# EAGLE design schematics (EAGLE 9.6.2)
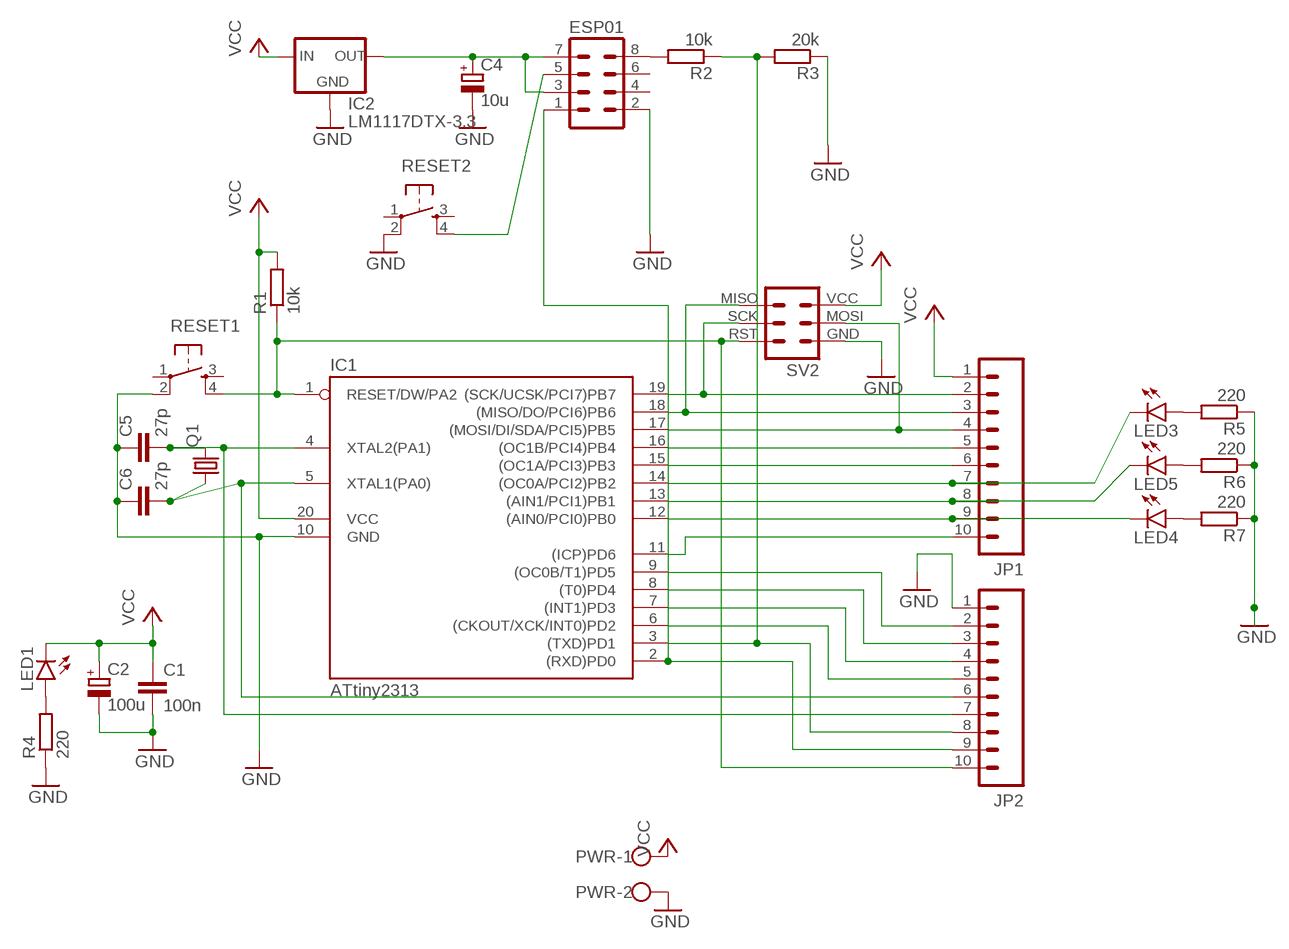
[diagram p0: schematic, sheet 1]

## Parts
C1  100n  C-EU025-025X050  [C025-025X050]
C2  100u  CPOL-EUE2.5-5  [E2,5-5]
C4  10u  CPOL-EUE2.5-5  [E2,5-5]
C5  27p  C2.5/2  [C2.5-2]
C6  27p  C2.5/2  [C2.5-2]
ESP01  MA04-2  [MA04-2]
IC1  ATtiny2313  ATTINY2313-20P  [DIL20]
IC2  LM1117DTX-3.3  [TO252]
JP1  M100.1  [1X10]
JP2  M100.1  [1X10]
LED1  LED3MM  [LED3MM]
LED3  LED3MM  [LED3MM]
LED4  LED3MM  [LED3MM]
LED5  LED3MM  [LED3MM]
PWR  W237-102  [W237-102]
Q1  CRYSTALHC49S  [HC49/S]
R1  10k  R-EU_0207/5V  [0207/5V]
R2  10k  R-EU_0207/5V  [0207/5V]
R3  20k  R-EU_0207/5V  [0207/5V]
R4  220  R-EU_0207/5V  [0207/5V]
R5  220  R-EU_0207/5V  [0207/5V]
R6  220  R-EU_0207/5V  [0207/5V]
R7  220  R-EU_0207/5V  [0207/5V]
RESET1  TAC_SWITCHPTH  [TACTILE-PTH]
RESET2  TAC_SWITCHPTH  [TACTILE-PTH]
SV2  MA03-2  [MA03-2]

## Nets
GND: C1.2 C2.- C4.- C5.1 C6.1 ESP01.2 IC1.10(GND) IC2.1(GND) JP2.1 PWR.2 R3.1 R4.1 R5.1 R6.1 R7.1 RESET1.2 RESET2.2 SV2.GND
N$1: C4.+ ESP01.3 ESP01.7 IC2.TAB(OUT)
N$2: C5.2 IC1.4(XTAL2(PA1)) JP2.7 Q1.2
N$3: C6.2 IC1.5(XTAL1(PA0)) JP2.6 Q1.1
N$4: IC1.1(RESET/DW/PA2) JP2.10 R1.1 RESET1.4 SV2.RST
N$5: IC1.19((SCK/UCSK/PCI7)PB7) JP1.2 SV2.SCK
N$6: IC1.18((MISO/DO/PCI6)PB6) JP1.3 SV2.MISO
N$7: IC1.17((MOSI/DI/SDA/PCI5)PB5) JP1.4 SV2.MOSI
N$8: IC1.16((OC1B/PCI4)PB4) JP1.5
N$9: IC1.15((OC1A/PCI3)PB3) JP1.6
N$10: IC1.14((OC0A/PCI2)PB2) JP1.7 LED3.K(C)
N$11: IC1.13((AIN1/PCI1)PB1) JP1.8 LED5.K(C)
N$12: IC1.12((AIN0/PCI0)PB0) JP1.9 LED4.K(C)
N$13: IC1.11((ICP)PD6) JP1.10
N$14: IC1.9((OC0B/T1)PD5) JP2.2
N$15: IC1.8((T0)PD4) JP2.3
N$16: IC1.7((INT1)PD3) JP2.4
N$17: IC1.6((CKOUT/XCK/INT0)PD2) JP2.5
N$18: IC1.3((TXD)PD1) JP2.8 R2.1 R3.2
N$19: ESP01.5 RESET2.4
N$20: ESP01.8 R2.2
N$22: LED1.A R4.2
N$23: LED3.A R5.2
N$24: LED5.A R6.2
N$25: LED4.A R7.2
RX: ESP01.1 IC1.2((RXD)PD0) JP2.9
VCC: C1.1 C2.+ IC1.20(VCC) IC2.2(IN) JP1.1 LED1.K(C) PWR.1 R1.2 SV2.VCC
Unconnected: ESP01.4 ESP01.6 RESET1.1 RESET1.3 RESET2.1 RESET2.3

## Library data of the parts
C1 = rcl:C-EU: CAPACITOR, European symbol; SPICEPREFIX: C
C2 C4 = rcl:CPOL-EU: POLARIZED CAPACITOR, European symbol; SPICEPREFIX: C
C5 C6 = capacitor-wima:C: CAPACITOR naming: grid - package width
ESP01 = con-lstb:MA04-2: PIN HEADER; OC_FARNELL: unknown; OC_NEWARK: unknown
IC1 = avr:ATTINY2313: MICROCONTROLLER 2 Kbytes FLASH 128 bytes SRAM 128 bytes EEPROM USART USI
IC2 = lm1117:LM1117DTX-*
JP1 JP2 = SparkFun:M10: Header 10 Standard 10-pin 0.1" header. Use with straight break away headers (SKU : PRT-00116), right angle break away headers (PRT-00553), swiss pins (PRT-00743), machine pins (PRT-00117), and female headers (PRT-00115).
LED1 LED3-LED5 = led:LED: LED OSRAM: - CHIPLED LG R971, LG N971, LY N971, LG Q971, LY Q971, LO R971, LY R971 LH N974, LH R974 LS Q976, LO Q976, LY Q976 LO Q996 - Hyper CHIPLED LW Q18S LB Q993, LB Q99A, LB R99A - SideLED LS A670, LO A670, LY A670, LG A670, LP A670 LB A673, LV A673, LT A673, LW A673 LH A674 LY A675 LS A676, LA A676, LO A676, LY A676, LW A676 LS A679, LY A679, LG A679 - Hyper Micro SIDELED® LS Y876, LA Y876, LO Y876, LY Y876 LT Y87S - SmartLED LW L88C, LW L88S LB L89C, LB L89S, LG L890 LS L89K, LO L89K, LY L89K LS L896, LA L896, LO L896, LY L896 - TOPLED LS T670, LO T670, LY T670, LG T670, LP T670 LSG T670, LSP T670, LSY T670, LOP T670, LYG T670 LG T671, LOG T671, LSG T671 LB T673, LV T673, LT T673, LW T673 LH T674 LS T676, LA T676, LO T676, LY T676, LB T676, LH T676, LSB T676, LW T676 LB T67C, LV T67C, LT T67C, LS T67K, LO T67K, LY T67K, LW E67C LS E67B, LA E67B, LO E67B, LY E67B, LB E67C, LV E67C, LT E67C LW T67C LS T679, LY T679, LG T679 LS T770, LO T770, LY T770, LG T770, LP T770 LB T773, LV T773, LT T773, LW T773 LH T774 LS E675, LA E675, LY E675, LS T675 LS T776, LA T776, LO T776, LY T776, LB T776 LHGB T686 LT T68C, LB T68C - Hyper Mini TOPLED® LB M676 - Mini TOPLED Santana® LG M470 LS M47K, LO M47K, LY M47K Source: http://www.osram.convergy.de LUXEON: - LUMILED® LXK2-PW12-R00, LXK2-PW12-S00, LXK2-PW14-U00, LXK2-PW14-V00 LXK2-PM12-R00, LXK2-PM12-S00, LXK2-PM14-U00 LXK2-PE12-Q00, LXK2-PE12-R00, LXK2-PE12-S00, LXK2-PE14-T00, LXK2-PE14-U00 LXK2-PB12-K00, LXK2-PB12-L00, LXK2-PB12-M00, LXK2-PB14-N00, LXK2-PB14-P00, LXK2-PB14-Q00 LXK2-PR12-L00, LXK2-PR12-M00, LXK2-PR14-Q00, LXK2-PR14-R00 LXK2-PD12-Q00, LXK2-PD12-R00, LXK2-PD12-S00 LXK2-PH12-R00, LXK2-PH12-S00 LXK2-PL12-P00, LXK2-PL12-Q00, LXK2-PL12-R00 Source: www.luxeon.com KINGBRIGHT: KA-3528ASYC Source: www.kingbright.com
PWR = con-wago-500:W237-102: WAGO SCREW CLAMP; MPN: 237-102; OC_FARNELL: unknown; OC_NEWARK: 70K9898
Q1 = crystal:CRYSTAL: CRYSTAL; OC_FARNELL: 1667008; OC_NEWARK: unknown
R1-R7 = rcl:R-EU_: RESISTOR, European symbol; SPICEPREFIX: R
RESET1 RESET2 = SparkFun:TAC_SWITCH: Momentary Switch Button commonly used for reset or general input. Spark Fun Electronics SKU : COM-00097
SV2 = alex:MA03-2: PIN HEADER

## Board
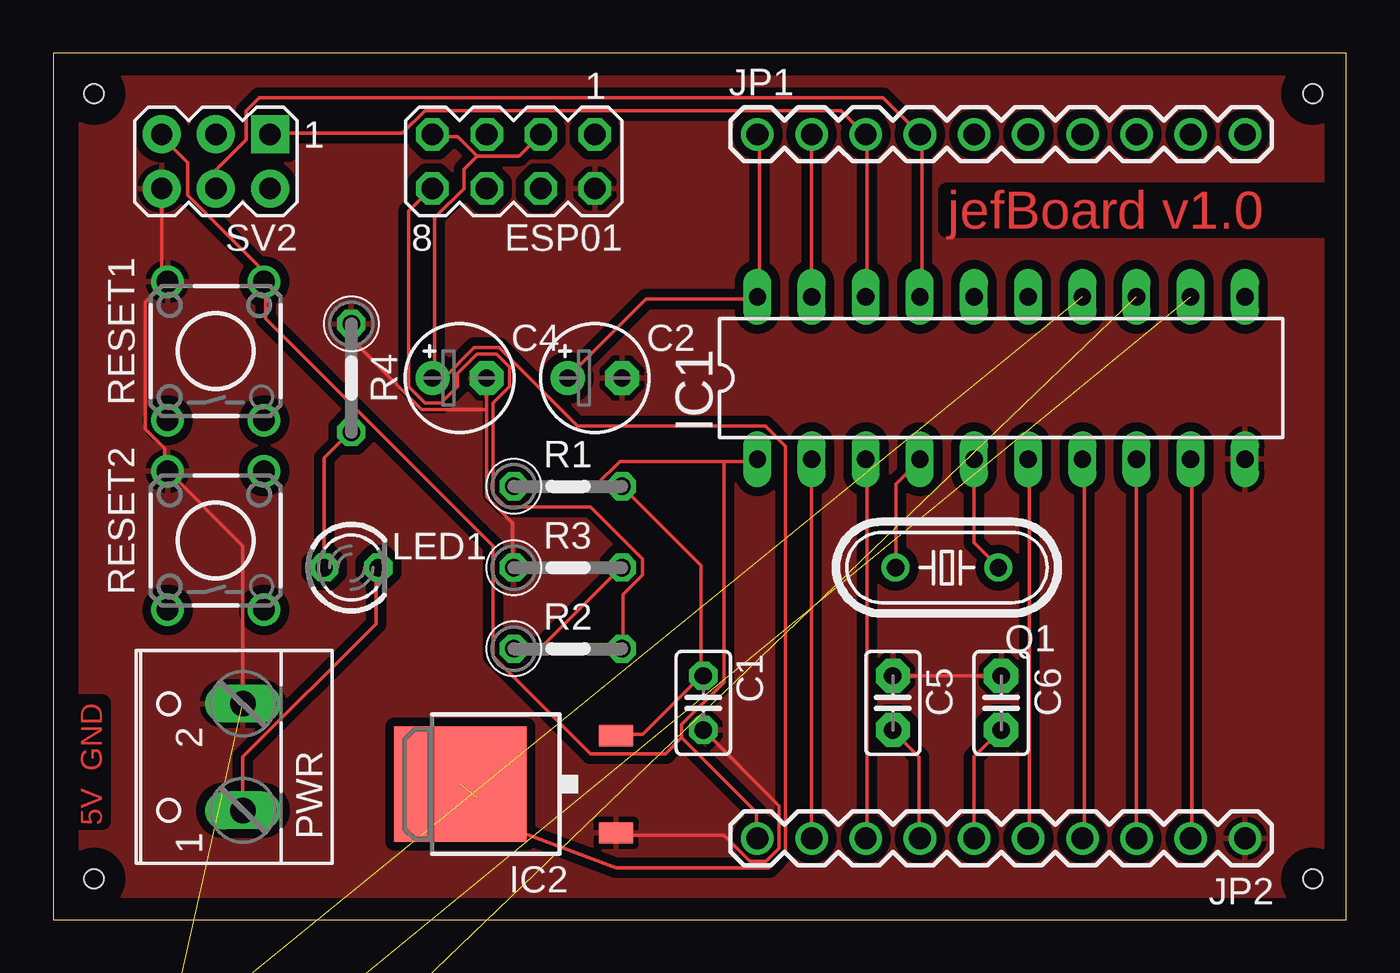
[diagram p1: board, top side]
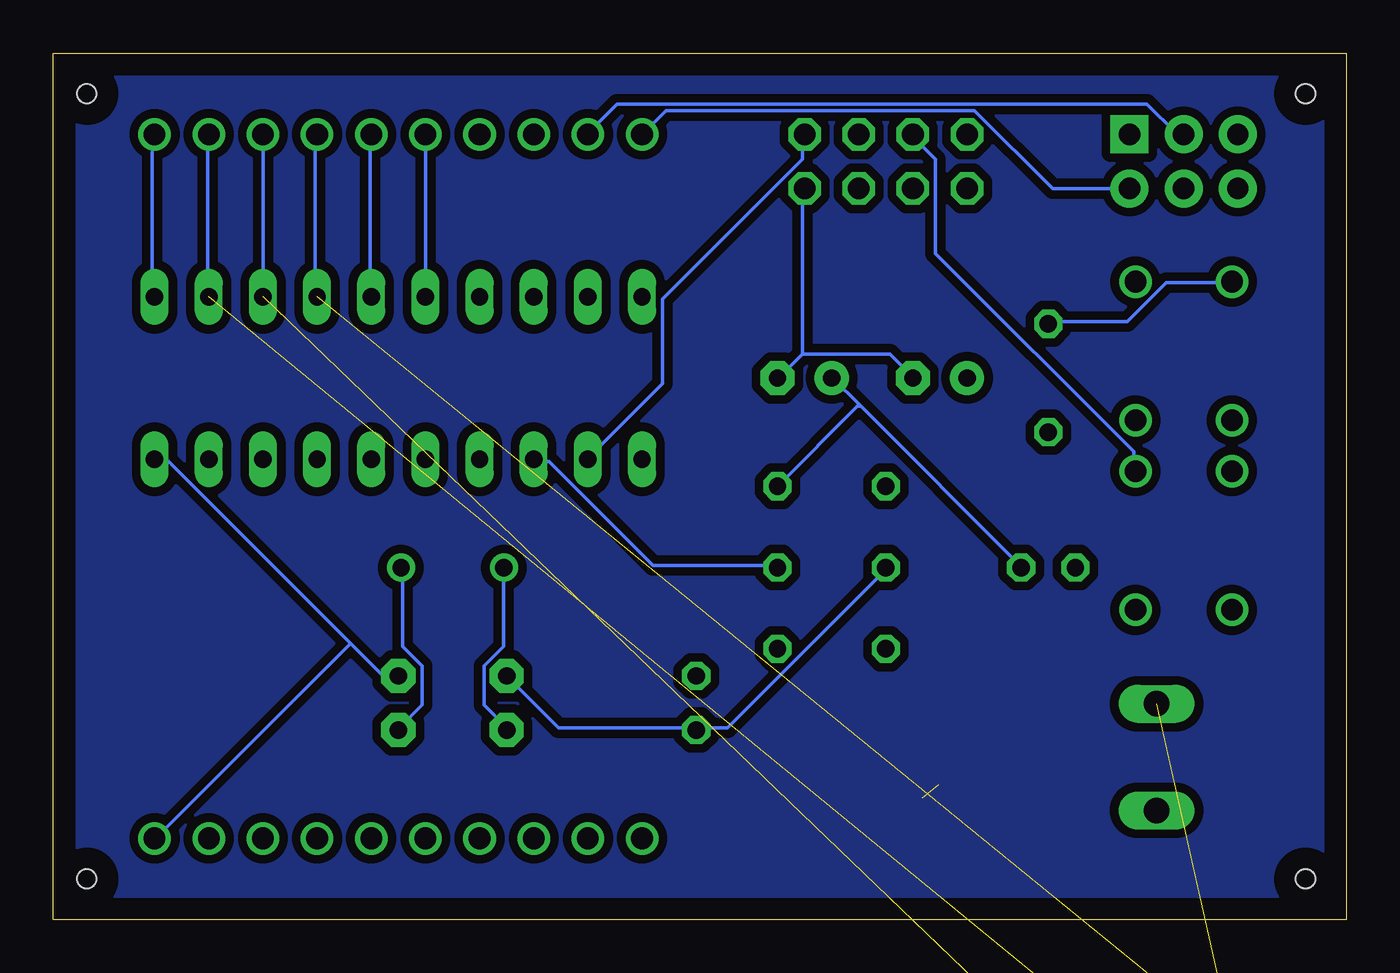
[diagram p2: board, bottom side, seen from below]

Size 60.63 x 40.63 mm. Coordinates in mm from the lower left corner, seen from the top.
Outline: 0,0 60.63,0 60.63,40.63 0,40.63 0,0
Copper layers (1*16): Top 0.035mm / dielectric 1.5mm / Bottom 0.035mm
Design rules "default": minimum track width 6mil, minimum drill 0.35mm, track to track 6mil, track to pad 6mil, pad to pad 6mil, via to via 6mil, smd to smd 6mil, copper to edge 40mil, drill to drill 6mil, minimum pad ring 10mil, minimum via ring 8mil, stop-mask expansion 4mil, vias tented up to drill 0mil, thermal gap 10mil
Holes 0.89 mm at 1.91,38.73 1.91,1.91 59.05,38.73 59.05,1.91

### Footprints (pad centres in the part's own frame; a part is rotated, then mirrored left to right if it is on the bottom)
C025-025X050 = drill 0.813 octagon: 1 -1.27,0; 2 1.27,0
E2,5-5 = drill 0.813 pad 1.6: + -1.27,0 | drill 0.813 pad 1.6 octagon: - 1.27,0
C2.5-2 = drill 0.813 pad 1.6 octagon: 1 -1.27,0; 2 1.27,0
MA04-2 = drill 1.016 octagon: 1 -3.81,-1.27; 2 -3.81,1.27; 3 -1.27,-1.27; 4 -1.27,1.27; 5 1.27,-1.27; 6 1.27,1.27; 7 3.81,-1.27; 8 3.81,1.27
DIL20 = drill 0.813 long: 1 -11.43,-3.81; 2 -8.89,-3.81; 3 -6.35,-3.81; 4 -3.81,-3.81; 5 -1.27,-3.81; 6 1.27,-3.81; 7 3.81,-3.81; 8 6.35,-3.81; 9 8.89,-3.81; 10 11.43,-3.81; 11 11.43,3.81; 12 8.89,3.81; 13 6.35,3.81; 14 3.81,3.81; 15 1.27,3.81; 16 -1.27,3.81; 17 -3.81,3.81; 18 -6.35,3.81; 19 -8.89,3.81; 20 -11.43,3.81
TO252 = smd 1 x 1.6: 1 -2.28,-4.8; 2 2.28,-4.8 | smd 5.4 x 6.2: TAB 0,2.5
1X10 = drill 1.016: 1 0,0; 2 2.54,0; 3 5.08,0; 4 7.62,0; 5 10.16,0; 6 12.7,0; 7 15.24,0; 8 17.78,0; 9 20.32,0; 10 22.86,0
LED3MM = drill 0.813 octagon: A -1.27,0; K 1.27,0
W237-102 = drill 1.194 long: 1 -2.5,-1.27; 2 2.5,-1.27
HC49/S = drill 0.813: 1 -2.413,0; 2 2.413,0
0207/5V = drill 0.813 octagon: 1 -2.54,0; 2 2.54,0
TACTILE-PTH = drill 1.016: 1 -3.251,2.261; 2 3.251,2.261; 3 -3.251,-2.261; 4 3.251,-2.261
MA03-2 = drill 1 pad 1.778: GND 2.54,1.27; MOSI 0,1.27; RST 2.54,-1.27; SCK 0,-1.27; VCC -2.54,1.27 | drill 1 pad 1.778 square: MISO -2.54,-1.27

### Placement (x,y rotation side)
C1  30.48,10.16 270 top
C2  25.4,25.4 0 top
C4  19.05,25.4 0 top
C5  39.37,10.16 270 top
C6  44.45,10.16 270 top
ESP01  21.59,35.56 180 top
IC1  44.45,25.4 0 top
IC2  21.59,6.35 90 top
JP1  33.02,36.83 0 top
JP2  55.88,3.81 180 top
LED1  13.97,16.51 0 top
LED3  2.54,-6.98 0 top  (outside the outline)
LED4  2.54,-11.43 0 top  (outside the outline)
LED5  2.54,-15.88 0 top  (outside the outline)
PWR  7.62,7.62 90 top
Q1  41.91,16.51 180 top
R1  24.13,20.32 0 top
R2  24.13,12.7 0 top
R3  24.13,16.51 0 top
R4  13.97,25.4 270 top
R5  4.45,-20.95 0 top  (outside the outline)
R6  4.45,-26.67 0 top  (outside the outline)
R7  4.45,-32.38 0 top  (outside the outline)
RESET1  7.62,26.67 90 top
RESET2  7.62,17.78 90 top
SV2  7.62,35.56 180 top

### Tracks (layer width: path | path; a pad name or v marks a point on that pad's centre or on a via)
GND  (3 unrouted)
  Top 0.152: C1.2 34.04,5.33 34.04,3.35 33.43,2.74 32.66,2.74 31.45,3.96 26.42,3.96 IC2.1 | C6.1 C5.1 | SV2.GND 5.08,30.17 5.23,30.02 RESET1.2 5.23,29.87 4.32,28.96 4.32,23.01 5.23,22.1 5.23,21.03 RESET2.2 5.38,21.03 8.89,17.53 PWR.2 | C4.- 20.32,23.93 | 20.32,23.93 20.32,19.81 21.54,18.59 21.54,16.61 R3.1 | 20.32,23.93 17.27,23.93 14.07,27.13 14.07,27.89 R4.1
  Bottom 0.152: 46.69,12.95 45.16,11.43 C6.1 | 46.69,12.95 55.22,21.49 55.83,21.49 IC1.10 | 46.69,12.95 55.83,3.81 JP2.1 | C5.1 36.93,8.99 30.53,8.99 C1.2 30.38,8.99 29.01,8.99 21.54,16.46 R3.1 | 25.5,26.52 25.5,34.29 ESP01.2 | 25.5,26.52 26.57,25.45 C2.- | 25.5,26.52 21.39,26.52 20.32,25.45 C4.- | RESET1.2 5.38,29.87 8.43,29.87 10.26,28.04 13.92,28.04 R4.1
  pour Top (isolate 0.406): 1.27,40.01 59.69,40.01 59.69,0.64 1.27,0.64
N$1  (1 unrouted)
  Top 0.152: 19.86,35.81 18.95,36.73 17.88,36.73 ESP01.7 | 19.86,35.81 21.84,35.81 ESP01.3 | 19.86,35.81 19.25,35.2 19.25,34.29 17.88,32.92 17.88,25.45 C4.+ 18.31,25.4 19.74,26.82 20.9,26.82 24.59,23.14 33.39,23.14 34.34,22.19 34.34,3.23 33.55,2.44 26.4,2.44 17.28,5.85 16.77,6.35 19.88,5.71
N$2
  Top 0.152: Q1.2 39.52,16.61 39.52,20.42 40.59,21.49 IC1.4 | JP2.7 40.59,3.81 40.59,7.62 39.37,8.84 C5.2
  Bottom 0.152: Q1.2 39.52,16.46 39.52,12.8 40.44,11.89 40.44,10.06 39.37,8.99 C5.2
N$3
  Top 0.152: IC1.5 43.18,17.68 44.25,16.61 Q1.1 | JP2.6 43.18,7.62 C6.2
  Bottom 0.152: Q1.1 44.25,16.46 44.25,12.8 43.33,11.89 43.33,10.06 44.4,8.99 C6.2
N$4
  Top 0.152: SV2.RST 5.08,36.73 6.3,35.51 6.3,33.98 9.8,30.48 9.8,30.02 RESET1.4 9.96,29.87 9.96,28.19 20.62,17.53 20.62,12.34 25.2,7.77 28.7,7.77 29.46,8.53 | 31.45,21.49 32.97,21.49 IC1.1 | 31.45,21.49 26.57,21.49 25.5,20.42 21.69,20.42 R1.1 | 29.46,8.53 32.97,5.03 32.97,3.81 JP2.10 | 29.46,8.53 29.46,9.14 31.45,11.12 31.45,21.49
N$5
  Top 0.152: JP1.2 IC1.19
  Bottom 0.152: SV2.SCK 7.67,36.88 7.98,36.88 9.35,38.25 34.19,38.25 35.56,36.88 JP1.2
N$6
  Top 0.152: IC1.18 38.15,29.26 38.15,36.73 JP1.3 38,36.88 36.93,37.95 17.42,37.95 16.36,36.88 10.26,36.88 SV2.MISO
N$7
  Top 0.152: IC1.17 40.74,29.26 40.74,36.73 JP1.4 38.91,38.56 9.65,38.56 9.04,37.95 9.04,36.58 7.67,35.2 7.67,34.29 SV2.MOSI
N$8
  Bottom 0.152: JP1.5 IC1.16
N$9
  Bottom 0.152: IC1.15 45.77,29.26 45.77,36.73 JP1.6
N$10  (1 unrouted)
  Bottom 0.152: IC1.14 48.36,29.26 48.36,36.73 JP1.7
N$11  (1 unrouted)
  Bottom 0.152: JP1.8 IC1.13
N$12  (1 unrouted)
  Bottom 0.152: IC1.12 53.39,29.26 53.39,36.73 JP1.9
N$13
  Bottom 0.152: IC1.11 55.98,29.26 55.98,36.73 JP1.10
N$14
  Top 0.152: IC1.9 53.39,21.49 53.39,3.81 JP2.2
N$15
  Top 0.152: JP2.3 IC1.8
N$16
  Top 0.152: IC1.7 48.36,21.49 48.36,3.81 JP2.4
N$17
  Top 0.152: IC1.6 45.77,21.49 45.77,3.81 JP2.5
N$18
  Top 0.152: R2.1 21.69,12.8 22.91,12.8 26.57,16.46 R3.2 | JP2.8 38.15,3.81 38.15,21.49 IC1.3
  Bottom 0.152: IC1.3 38,21.49 37.39,21.49 32.51,16.61 26.72,16.61 R3.2
N$19
  Bottom 0.152: RESET2.4 9.96,21.03 9.96,21.95 19.25,31.24 19.25,35.66 20.32,36.73 ESP01.5
N$20
  Top 0.152: R2.2 26.72,12.8 26.72,15.24 27.63,16.15 27.63,16.92 25.2,19.36 21.23,19.36 20.62,19.96 20.62,24.23 21.39,24.99 21.39,25.91 20.78,26.52 19.86,26.52 18.95,25.6 18.95,24.99 18.19,24.23 17.42,24.23 16.66,24.99 16.66,33.22 17.73,34.29 ESP01.8
N$21
  pour Bottom (isolate 0.406): 0.64,40.01 59.69,40.01 59.69,0.64 0.64,0.64
N$22
  Top 0.152: LED1.A 12.7,21.64 13.92,22.86 R4.2
N$23  (1 unrouted)
N$24  (1 unrouted)
N$25  (1 unrouted)
RX
  Top 0.152: JP2.9 IC1.2
  Bottom 0.152: ESP01.1 25.5,36.73 25.5,35.66 32.05,29.11 32.05,25.15 35.56,21.64 IC1.2
VCC
  Top 0.152: JP1.1 33.12,36.73 33.12,29.26 IC1.20 32.97,29.11 27.79,29.11 24.13,25.45 C2.+ | 30.38,11.43 27.63,8.69 26.42,8.69 IC2.2 | PWR.1 8.89,7.62 15.14,13.87 15.14,16.46 LED1.K | 30.38,11.43 30.38,16.61 R1.2 | 30.38,11.43 C1.1
  Bottom 0.152: SV2.VCC 13.77,34.29 17.42,37.95 31.9,37.95 JP1.1 | 22.76,24.08 24.13,25.45 C2.+ | 22.76,24.08 15.29,16.61 LED1.K | R1.2 22.91,24.08 22.76,24.08

### Text on the board
Top: jefBoard v1.0 | 5V GND